# EAGLE design EL_Doorsign (EAGLE 5.06)
MFG: PCBWAY; MPN: EL_DOORSIGN_REV_A; PRICE: 5.00; VENDOR: PCBWAY; VPN: EL_DOORSIGN_REV_A
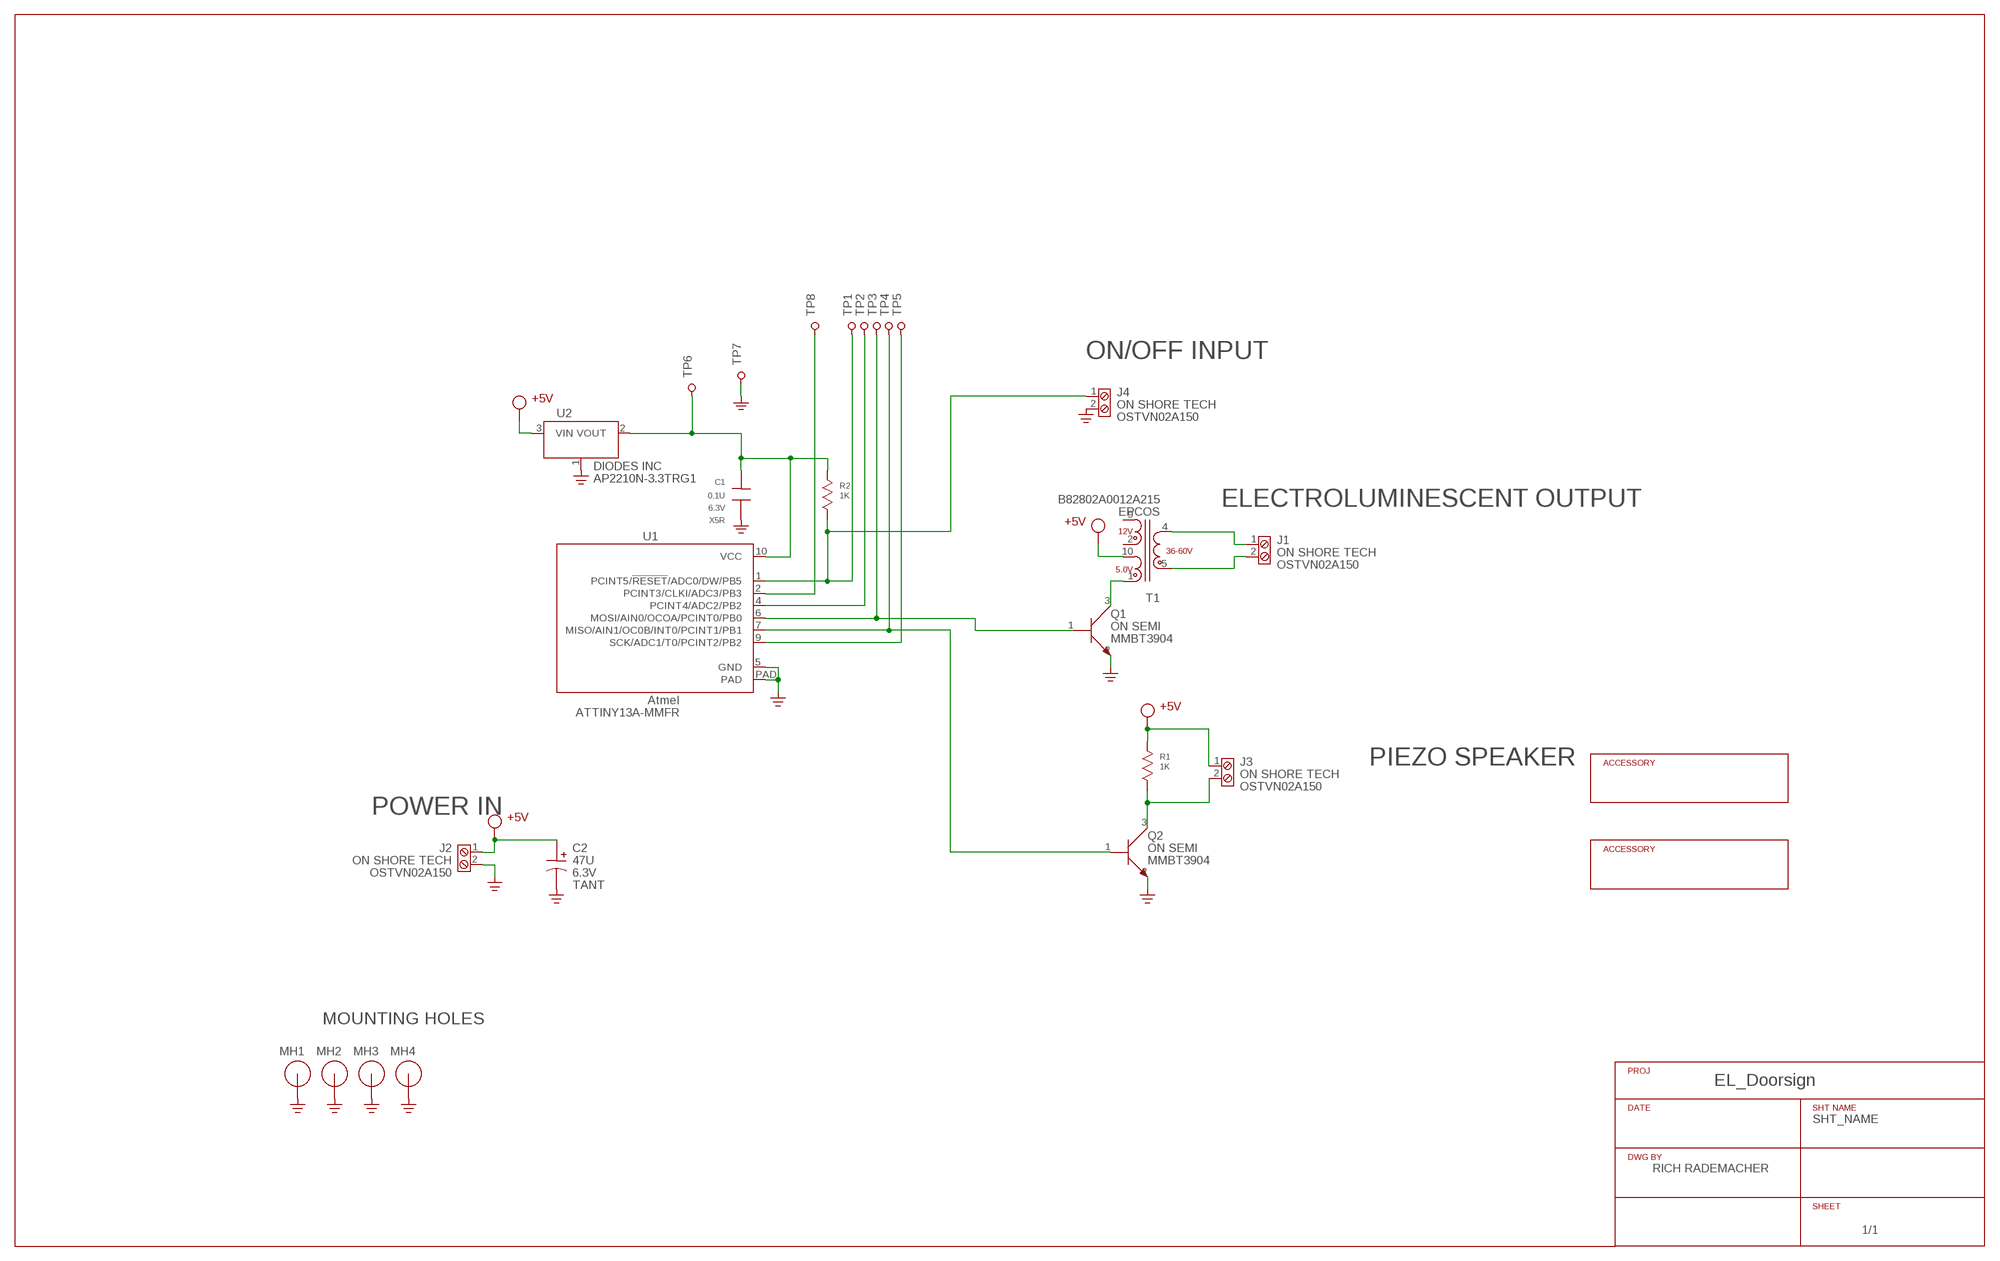
[diagram p0: schematic, sheet 1]
U$1 (TITLEBLOCK): AUTHOR: RICH RADEMACHER; DO_NOT_BOM: TRUE; SHT_NAME: SHT_NAME

## Parts
C1  0.1U  CAP-NP-0603  [R-0603]
C2  47U  CAP-POL-SIZED  [CAP-SIZE_D/E_EIA7343]
J1  CONN_SCREWTERM_2.54MM_2POS  [OST_SCREWTERM_2.54MM_2POS]
J2  CONN_SCREWTERM_2.54MM_2POS  [OST_SCREWTERM_2.54MM_2POS]
J3  CONN_SCREWTERM_2.54MM_2POS  [OST_SCREWTERM_2.54MM_2POS]
J4  CONN_SCREWTERM_2.54MM_2POS  [OST_SCREWTERM_2.54MM_2POS]
MH1  MTG-HOLE-4-40  [MTG-4-40]
MH2  MTG-HOLE-4-40  [MTG-4-40]
MH3  MTG-HOLE-4-40  [MTG-4-40]
MH4  MTG-HOLE-4-40  [MTG-4-40]
Q1  NPN-3904  [SOT23-3]
Q2  NPN-3904  [SOT23-3]
R1  1K  RESISTOR-0603  [R-0603]
R2  1K  RESISTOR-0603  [R-0603]
T1  XFMR_B82802A  [EFD15]
TP1  TESTPT-40  [VIA-40MIL]
TP2  TESTPT-40  [VIA-40MIL]
TP3  TESTPT-40  [VIA-40MIL]
TP4  TESTPT-40  [VIA-40MIL]
TP5  TESTPT-40  [VIA-40MIL]
TP6  TESTPT-40  [VIA-40MIL]
TP7  TESTPT-40  [VIA-40MIL]
TP8  TESTPT-40  [VIA-40MIL]
U1  MCU-ATTINY13A  [MLF10]
U2  REG-AP2210  [SOT23-3]

## Nets
+5V: C2.+ J2.1 J3.1 R1.B T1.10(X1B) U2.3(VIN)
GND: C1.B C2.- J2.2 J4.2 MH1.P$1 MH2.P$1 MH3.P$1 MH4.P$1 Q1.2(E) Q2.2(E) TP7.P$1 U1.5(GND) U1.PAD U2.1(GND)
N$1: Q1.3(C) T1.1(X1A)
N$2: J3.2 Q2.3(C) R1.A
N$3: Q2.1(B) TP4.P$1 U1.7(MISO/AIN1/OC0B/INT0/PCINT1/PB1)
N$4: J1.2 T1.5(H1A)
N$5: J1.1 T1.4(H1B)
N$6: J4.1 R2.A TP1.P$1 U1.1(PCINT5/!RESET!/ADC0/DW/PB5)
N$7: C1.A R2.B TP6.P$1 U1.10(VCC) U2.2(VOUT)
N$8: Q1.1(B) TP3.P$1 U1.6(MOSI/AIN0/OCOA/PCINT0/PB0)
N$9: TP5.P$1 U1.9(SCK/ADC1/T0/PCINT2/PB2)
N$10: TP2.P$1 U1.4(PCINT4/ADC2/PB2)
N$11: TP8.P$1 U1.2(PCINT3/CLKI/ADC3/PB3)
Unconnected: T1.2(X2A) T1.9(X2B)

## Notes on the sheet
- ON/OFF INPUT
- ELECTROLUMINESCENT OUTPUT
- PIEZO SPEAKER
- POWER IN
- MOUNTING HOLES

## Library data of the parts
C1 = EL_Doorsign:CAP-NP; COST: 0.074; DIELECTRIC: X5R; SOLIDMODEL: CAP_NP_0603.g; SOLIDWORKS_CONFIG: SIZE_0603; SOLIDWORKS_FILE: ChipCapacitor.SLDASM; VOLTAGE: 6.3V
C2 = EL_Doorsign:CAP-POL; COST: 1.50; DIELECTRIC: TANT; MFG: AVX; MPN: TAJD-SERIES; SOLIDMODEL: CAP_TANT_SIZE_D.G; SOLIDWORKS_CONFIG: SIZE_D; SOLIDWORKS_FILE: TantalumCap.SLDASM; VENDOR: DIGIKEY; VOLTAGE: 6.3V
J1-J4 = EL_Doorsign:CONN_SCREWTERM_2.54MM_2POS: CONN TERM BLOCK 2.54MM 2POS PCB; MFG: ON SHORE TECH; MPN: OSTVN02A150; PRICE: 1.24; VENDOR: DIGIKEY; VPN: ED10561-ND
MH1-MH4 = EL_Doorsign:MTG-HOLE-4-40; DO_NOT_BOM: TRUE
Q1 Q2 = EL_Doorsign:NPN-3904: NPN General Purpose Amplifier; MFG: ON SEMI; MPN: MMBT3904; PRICE: 0.26; VENDOR: DIGIKEY; VPN: MMPT3904FSCT-ND
R1 R2 = EL_Doorsign:RESISTOR; PACKAGE: 0603; PRICE: .059; SOLIDMODEL: res0603.g; SOLIDWORKS_CONFIG: SIZE_0603; SOLIDWORKS_FILE: ChipResistor.SLDASM; TOLERANCE: 1%
T1 = EL_Doorsign:XFMR_B82802A: SMT flyback transformers; MFG: EPCOS; MPN: B82802A0012A215; PRICE: 6.94; VENDOR: DIGIKEY; VPN: 495-4445-1-ND
TP1-TP8 = EL_Doorsign:TESTPT: UNATTACHED TEST POINTS; DO_NOT_BOM: TRUE
U1 = EL_Doorsign:MCU-ATTINY13A: 8-bit Microcontroller with 1K Bytes In-System Programmable Flash; MFG: Atmel; MPN: ATTINY13A-MMFR; PRICE: 1.28; VENDOR: DIGIKEY; VPN: ATTINY13A-MMFRCT-ND
U2 = EL_Doorsign:REG-AP2210: 300mA LDO REGULATOR; MFG: DIODES INC; MPN: AP2210N-3.3TRG1; PRICE: 0.62; VENDOR: DIGIKEY; VPN: AP2210N-3.3TRG1DICT-ND

## Board
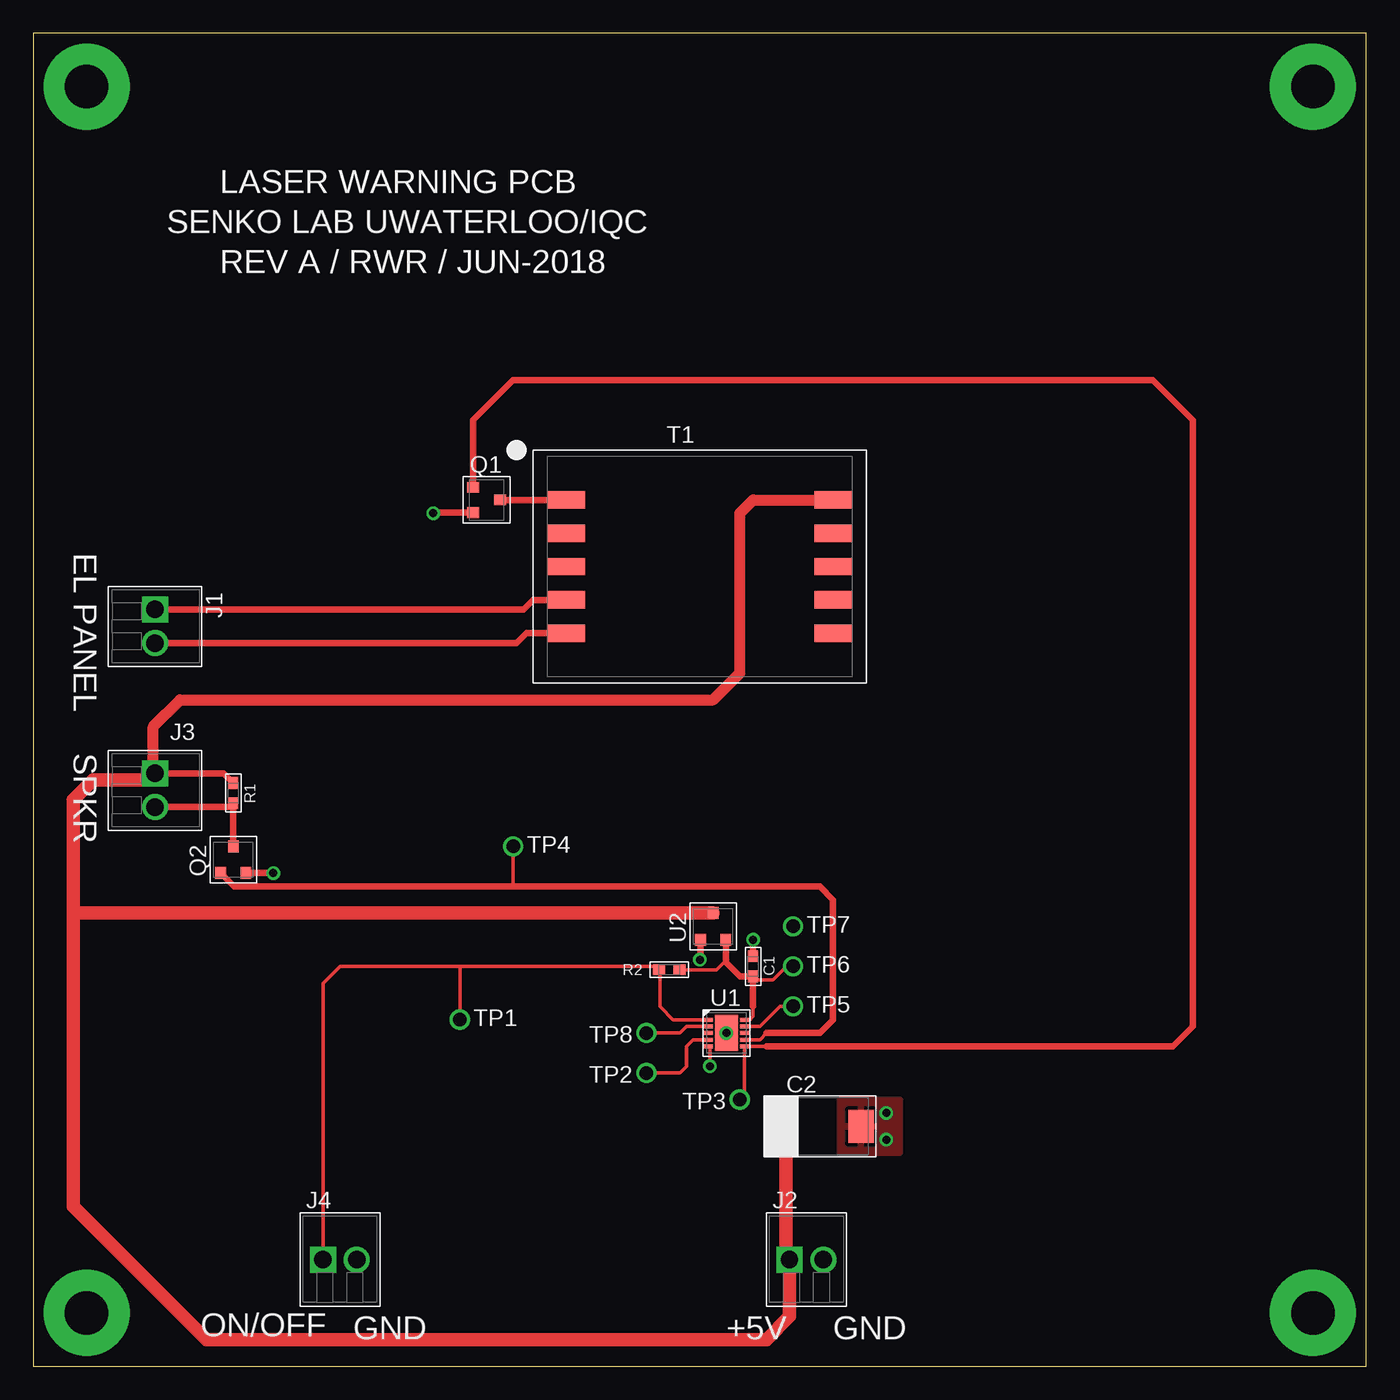
[diagram p1: board, top side]
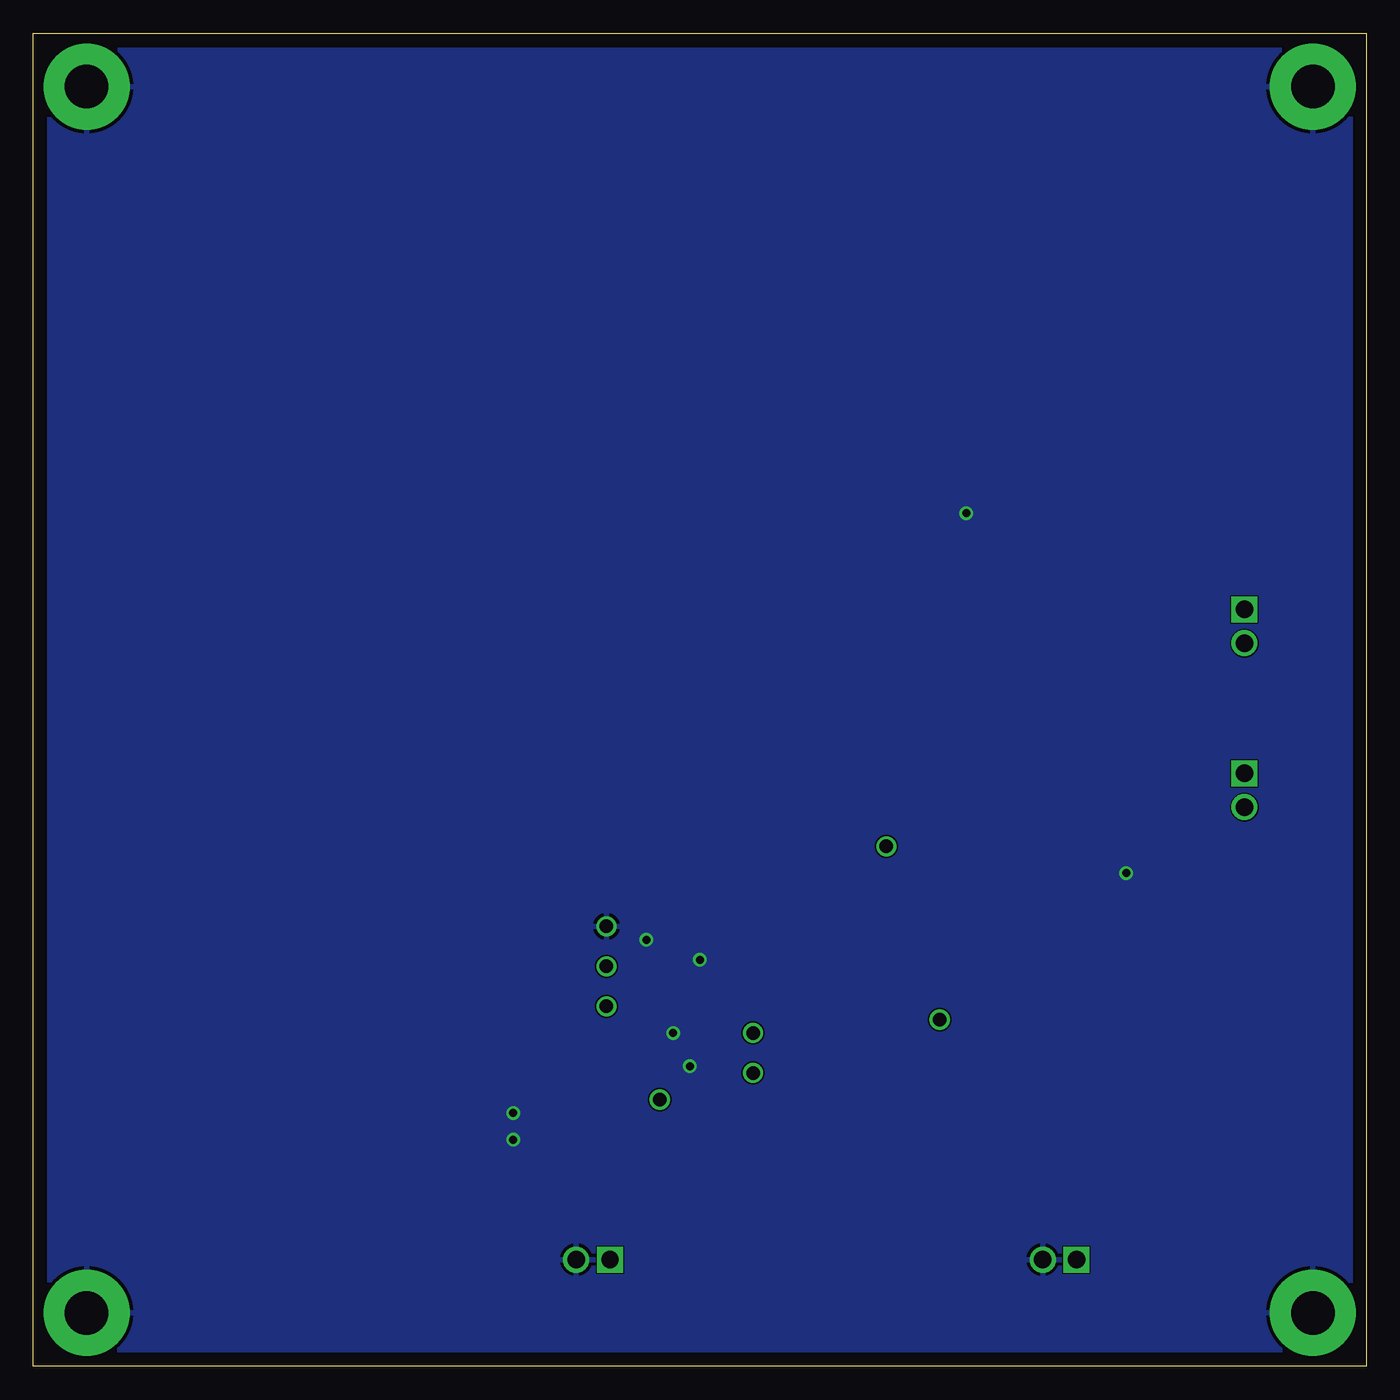
[diagram p2: board, bottom side, seen from below]

Size 100 x 100 mm. Coordinates in mm from the lower left corner, seen from the top.
Outline: 0,0 100,0 100,100 0,100 0,0
Copper layers (1+16): Top 0.035mm / dielectric 1.5mm / Bottom 0.035mm
Design rules "default *": minimum track width 10mil, minimum drill 24mil, track to track 4mil, track to pad 4mil, pad to pad 4mil, via to via 4mil, smd to smd 4mil, copper to edge 40mil, drill to drill 8mil, minimum pad ring 10mil, minimum via ring 8mil, stop-mask expansion 4mil, vias tented up to drill 0mil, thermal gap 10mil
Milling: 4 lines

### Footprints (pad centres in the part's own frame; a part is rotated, then mirrored left to right if it is on the bottom)
R-0603 = smd 0.889 x 0.762: A -0.762,0; B 0.762,0
CAP-SIZE_D/E_EIA7343 = smd 1.9 x 2.5: + -3.1,0; - 3.1,0
OST_SCREWTERM_2.54MM_2POS = drill 1.3 square: 1 -1.27,0 | drill 1.3 round: 2 1.27,0
MTG-4-40 = drill 3.264 pad 6.452 round: P$1 0,0
SOT23-3 = smd 0.8 x 0.9: 1 -0.95,-1; 2 0.95,-1; 3 0,1
EFD15 = smd 2.8 x 1.3: 1 -10,5; 2 -10,2.5; 3 -10,0; 4 -10,-2.5; 5 -10,-5; 6 10,-5; 7 10,-2.5; 8 10,0; 9 10,2.5; 10 10,5
VIA-40MIL = drill 1.016 round: P$1 0,0
MLF10 = smd 0.65 x 0.3: 1 -1.35,1; 2 -1.35,0.5; 3 -1.35,0; 4 -1.35,-0.5; 5 -1.35,-1; 6 1.35,-1; 7 1.35,-0.5; 8 1.35,0; 9 1.35,0.5; 10 1.35,1 | smd 1.75 x 2.7: PAD 0,0

### Placement (x,y rotation side)
C1  54,30 90 top
C2  59,18 0 top
J1  9.13,55.51 270 top
J2  58,8 0 top
J3  9.13,43.21 270 top
J4  23,8 0 top
MH1  4,4 0 top
MH2  96,4 0 top
MH3  96,96 0 top
MH4  4,96 0 top
Q1  34,65 270 top
Q2  15,38 0 top
R1  15,43 90 top
R2  47.71,29.75 0 top
T1  50,60 0 top
TP1  32,26 0 top
TP2  46,22 180 top
TP3  53,20 180 top
TP4  36,39 0 top
TP5  57,27 0 top
TP6  57,30 0 top
TP7  57,33 0 top
TP8  46,25 180 top
U1  52,25 0 top
U2  51,33 0 top

### Tracks (layer width: path | path; a pad name or v marks a point on that pad's centre or on a via)
+5V
  Top 0.5: J3.1 14.28,44.48 R1.B
  Top 0.813: T1.10 54,65 53,64 53,52 51,50 11,50 9,48 9,44.61 J3.1
  Top 1: 3,34 3,12 13,2 55,2 56.73,3.73 J2.1 56.45,8.28 56.45,17.45 | 3,34 3,42.5 4.5,44 8.65,44 J3.1 | 56.45,17.45 56.87,17.03 | 56.45,17.45 C2.+ | 3,34 U2.3
GND  (via drill 0.6)
  Top 0.25: U1.5 50.75,24 v50.75,22.5
  Top 0.5: Q1.2 30.05,64.05 v30,64 | Q2.2 v18,37 | C1.B v54,32 | v50,30.5 50.05,30.55 U2.1
  other vias: 52,25 64,19 64,17
  pour Bottom: 1,1 99,1 99,99 1,99
  pour Top: 60.5,20 65,20 65,16 60.5,16
N$1
  Top 0.5: Q1.3 T1.1
N$2
  Top 0.5: Q2.3 R1.A 14.7,41.94 J3.2
N$3
  Top 0.25: U1.7 54.5,24.5 55,25 | 36,36 TP4.P$1
  Top 0.5: 55,25 59,25 60,26 60,35 59,36 36,36 15.05,36 Q2.1
N$4
  Top 0.5: J1.2 36.24,54.24 37,55 T1.5
N$5
  Top 0.5: J1.1 36.78,56.78 37.5,57.5 T1.4
N$6
  Top 0.25: 32,30 23,30 21.73,28.73 J4.1 | 32,30 46.7,30 R2.A 47,29.7 47,27 48,26 U1.1 | 32,30 TP1.P$1
N$7
  Top 0.25: U1.10 53.75,26 54,26.25 54,27 | R2.B 51.25,29.75 51.8,30.3 51.95,30.3 | C1.A 54.24,29 55.5,29 56.5,30 TP6.P$1
  Top 0.5: U2.2 51.95,30.3 53,29.25 53.99,29.25 C1.A 54,27
N$8
  Top 0.25: 55,24 U1.6 53.35,20.35 TP3.P$1
  Top 0.5: Q1.1 33,71 36,74 84,74 87,71 87,25.5 85.5,24 55,24
N$9
  Top 0.25: U1.9 54.5,25.5 56,27 TP5.P$1
N$10
  Top 0.25: U1.4 49.5,24.5 49,24 49,22.5 48.5,22 TP2.P$1
N$11
  Top 0.25: TP8.P$1 48.5,25 49,25.5 U1.2

### Text on the board
tPlace: LASER WARNING PCB | SENKO LAB UWATERLOO/IQC | REV A / RWR / JUN-2018 | EL PANEL | SPKR | ON/OFF | GND | +5V | GND